# EAGLE design DHT11 Board (EAGLE 8.5.1)
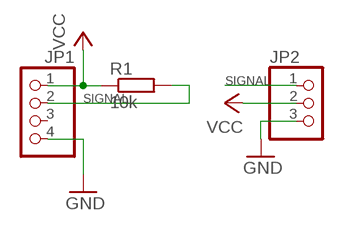
[diagram p0: schematic, sheet 1]

## Parts
JP1  PINHD-1X4  [1X04]
JP2  PINHD-1X3  [1X03]
R1  10k  R-EU_0204/7  [0204/7]

## Nets
GND: JP1.4 JP2.3
SIGNAL: JP1.2 JP2.1 R1.2
VCC: JP1.1 JP2.2 R1.1
Unconnected: JP1.3

## Library data of the parts
JP1 = pinhead:PINHD-1X4: PIN HEADER
JP2 = pinhead:PINHD-1X3: PIN HEADER
R1 = resistor:R-EU_: RESISTOR, European symbol

## Board
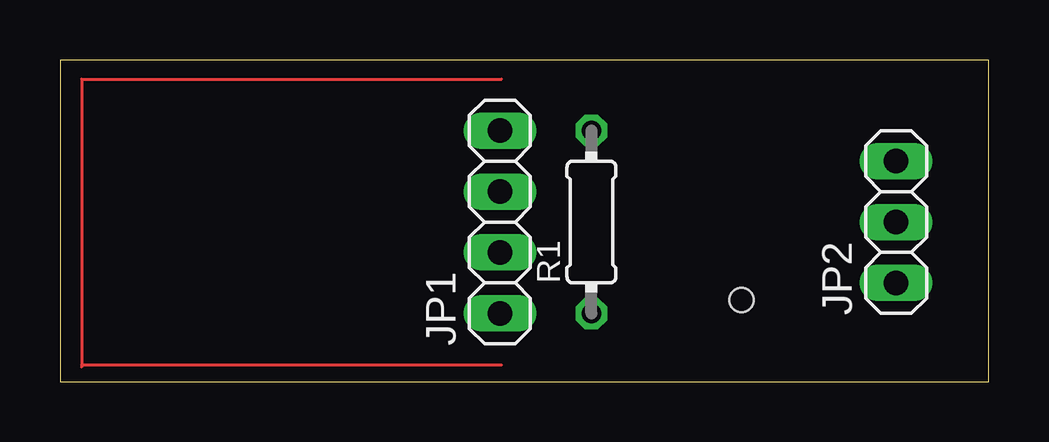
[diagram p1: board, top side]
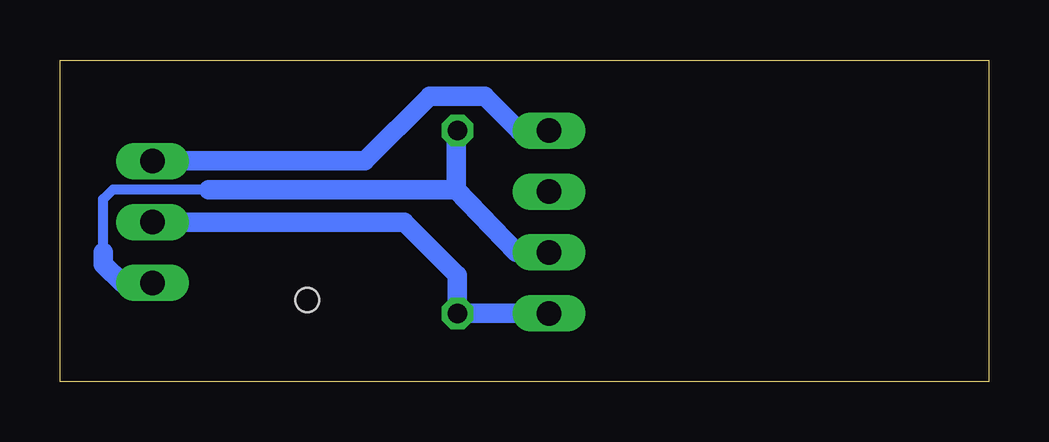
[diagram p2: board, bottom side, seen from below]

Size 38.7 x 13.4 mm. Coordinates in mm from the lower left corner, seen from the top.
Outline: 0,0 38.7,0 38.7,13.4 0,13.4 0,0
Copper layers (1*16): Top 0.035mm / dielectric 1.5mm / Bottom 0.035mm
Design rules "default": minimum track width 6mil, minimum drill 0.35mm, track to track 6mil, track to pad 6mil, pad to pad 6mil, via to via 6mil, smd to smd 6mil, copper to edge 40mil, drill to drill 6mil, minimum pad ring 10mil, minimum via ring 8mil, stop-mask expansion 4mil, vias tented up to drill 0mil, thermal gap 10mil
Holes 1 mm at 28.4,3.4

### Footprints (pad centres in the part's own frame; a part is rotated, then mirrored left to right if it is on the bottom)
1X04 = drill 1.016 long: 1 -3.81,0; 2 -1.27,0; 3 1.27,0; 4 3.81,0
1X03 = drill 1.016 long: 1 -2.54,0; 2 0,0; 3 2.54,0
0204/7 = drill 0.813 octagon: 1 -3.81,0; 2 3.81,0

### Placement (x,y rotation side)
JP1  18.33,6.65 90 top
JP2  34.84,6.65 90 top
R1  22.14,6.65 90 top

### Tracks (layer width: path | path; a pad name or v marks a point on that pad's centre or on a via)
GND
  Bottom 0.813: JP1.4 19.56,10.46 21,11.9 23.3,11.9 26,9.2 JP2.3
SIGNAL
  Bottom 0.406: 32.5,8 36.5,8 36.9,7.6 36.9,5.4
  Bottom 0.813: JP1.2 19.68,5.38 22.2,8 | 22.2,8 22.2,10.4 R1.2 | 22.2,8 32.5,8 | JP2.1 36.11,4.11 36.9,4.9 36.9,5.4
VCC
  Bottom 0.813: JP1.1 R1.1 22.14,4.44 24.35,6.65 JP2.2
(copper drawn outside any net)
  shapes: Top area x3